# Altium schematic sheet ChangeLog.SchDoc
size A4
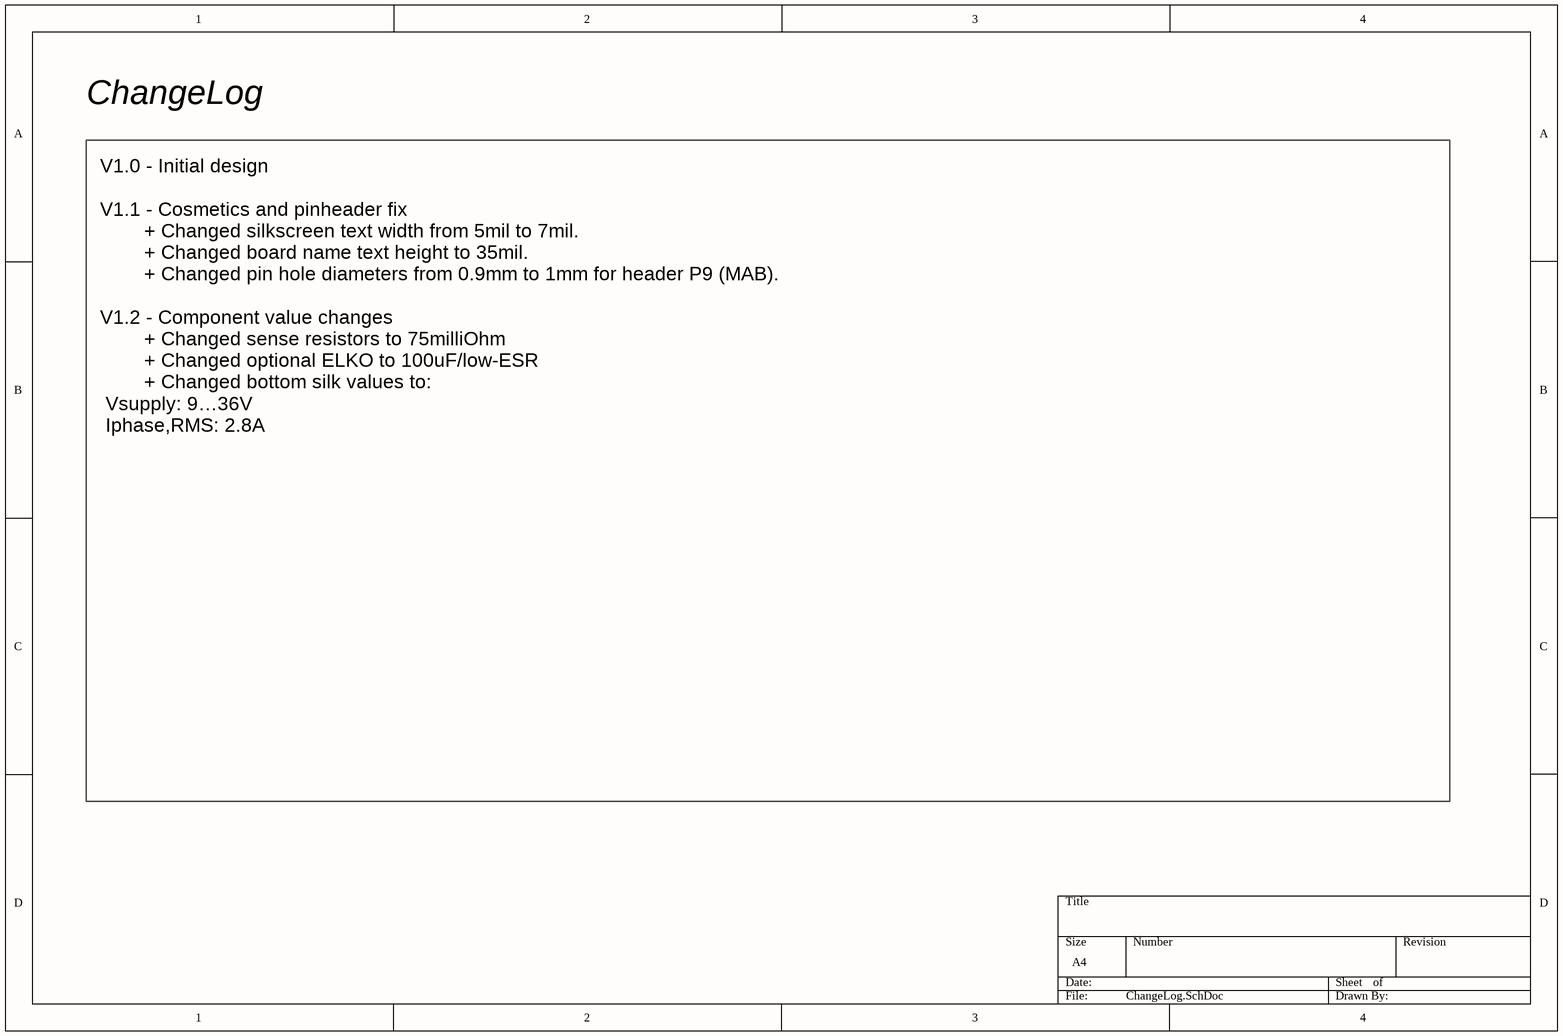
[diagram p0: ChangeLog.SchDoc]

## Notes on the sheet
- ChangeLog
- V1.0 - Initial design
  V1.1 - Cosmetics and pinheader fix
  + Changed silkscreen text width from 5mil to 7mil.
  + Changed board name text height to 35mil.
  + Changed pin hole diameters from 0.9mm to 1mm for header P9 (MAB).
  V1.2 - Component value changes
  + Changed sense resistors to 75milliOhm
  + Changed optional ELKO to 100uF/low-ESR
  + Changed bottom silk values to:
  Vsupply: 9…36V
  Iphase,RMS: 2.8A